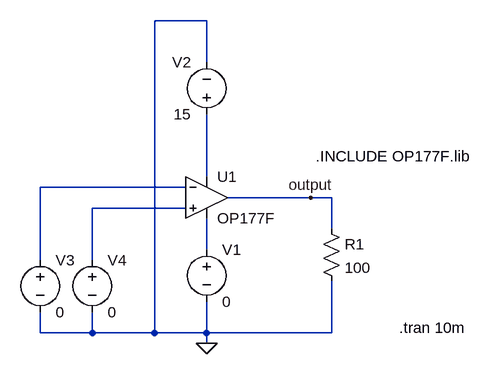
[diagram p0: schematic OP177F.asc]
OP177F.asc, the LTspice schematic file:
Version 4
SHEET 1 880 680
WIRE 176 -144 96 -144
WIRE 176 -80 176 -144
WIRE 176 96 176 0
WIRE 144 112 -80 112
WIRE 336 128 208 128
WIRE 368 128 336 128
WIRE 144 144 0 144
WIRE 368 176 368 128
WIRE 176 208 176 160
WIRE -80 224 -80 112
WIRE 0 224 0 144
WIRE -80 336 -80 304
WIRE 0 336 0 304
WIRE 0 336 -80 336
WIRE 96 336 96 -144
WIRE 96 336 0 336
WIRE 176 336 176 288
WIRE 176 336 96 336
WIRE 368 336 368 256
WIRE 368 336 176 336
WIRE 176 352 176 336
FLAG 176 352 0
FLAG 336 128 output
SYMBOL Opamps\\opamp2 176 64 R0
SYMATTR InstName U1
SYMATTR Value OP177F
SYMBOL voltage 176 192 R0
WINDOW 123 0 0 Left 2
WINDOW 39 0 0 Left 2
SYMATTR InstName V1
SYMATTR Value 0
SYMBOL voltage 176 16 R180
WINDOW 0 24 96 Left 2
WINDOW 3 24 16 Left 2
WINDOW 123 0 0 Left 2
WINDOW 39 0 0 Left 2
SYMATTR InstName V2
SYMATTR Value 15
SYMBOL res 352 160 R0
SYMATTR InstName R1
SYMATTR Value 100
SYMBOL voltage -80 208 R0
WINDOW 123 0 0 Left 2
WINDOW 39 0 0 Left 2
SYMATTR InstName V3
SYMATTR Value 0
SYMBOL voltage 0 208 R0
WINDOW 123 0 0 Left 2
WINDOW 39 0 0 Left 2
SYMATTR InstName V4
SYMATTR Value 0
TEXT 344 64 Left 2 !.INCLUDE OP177F.lib
TEXT 472 328 Left 2 !.tran 10m

The netlist it stands for:
* OP177F.asc
XU1 N003 N002 N001 N004 output OP177F  ; pins In+ In- V+ V- OUT
V1 N004 0 0
V2 N001 0 15
R1 output 0 100
V3 N002 0 0
V4 N003 0 0
.INCLUDE OP177F.lib
.tran 10m
.backanno
.end